# Altium schematic sheet TopLevelBlock.SchDoc: Low Power MCU to cloud reference
size A4; DrawnBy: Dheeraj R; DocumentNumber: 1; Revision: 2.0; SheetNumber: 1; SheetTotal: 5
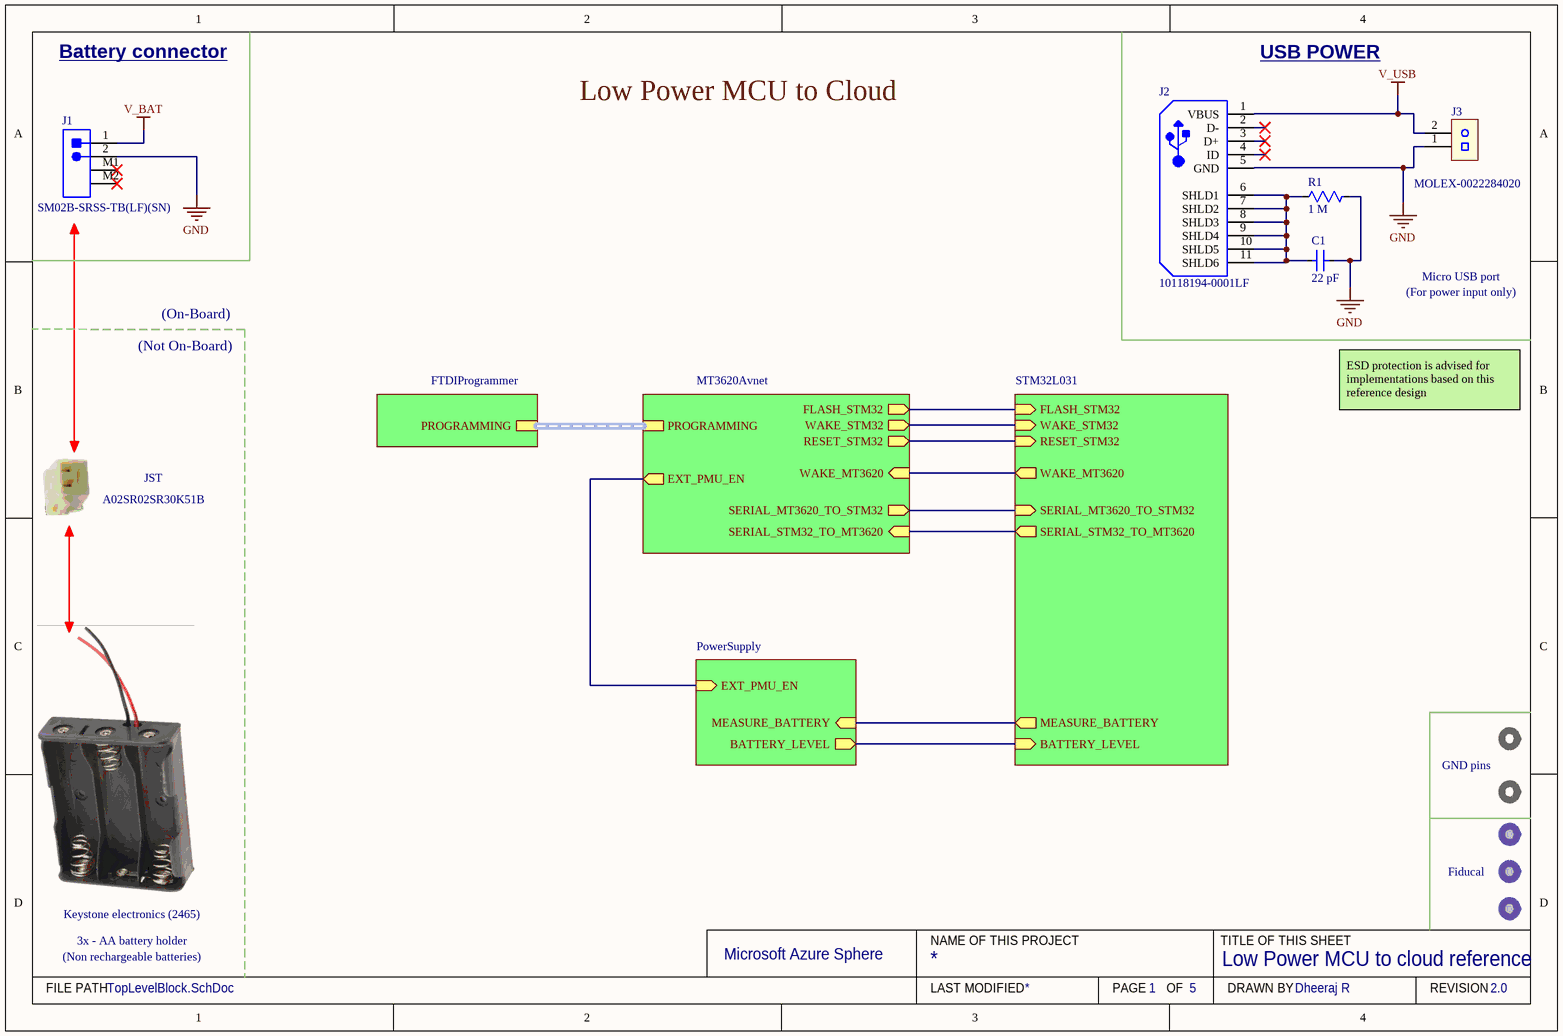
[diagram p0: TopLevelBlock.SchDoc]

## Parts
C1  22 pF  [CC0603]
J1  SM02B-SRSS-TB(LF)(SN)  [SM02B-SRSS-TB]
J2  Manufacturer Part Number: 10118194-0001LF  [FCI-10118194-0001LF-5_V no slots]  (hidden comment: Amphenol FCI 10118194-0001LF)
J3  MOLEX-0022284020  [0022284020]
R1  1 M  [RC0603]

## Sub-sheets
FTDIProgrammer = FTDIProgrammer.SchDoc: PROGRAMMING (harness FTDIHeader)
MT3620Avnet = MT3620AvnetModule.SchDoc: SERIAL_MT3620_TO_STM32 (out), SERIAL_STM32_TO_MT3620 (in), FLASH_STM32 (out), RESET_STM32 (out), WAKE_MT3620 (in), WAKE_STM32 (out), PROGRAMMING (harness FTDIHeader), EXT_PMU_EN (out)
PowerSupply = PowerSupply.SchDoc: EXT_PMU_EN (in), MEASURE_BATTERY (in), BATTERY_LEVEL (out)
STM32L031 = STM32L031.SchDoc: SERIAL_STM32_TO_MT3620 (out), FLASH_STM32 (in), WAKE_MT3620 (out), WAKE_STM32 (in), RESET_STM32 (in), MEASURE_BATTERY (out), BATTERY_LEVEL (in), SERIAL_MT3620_TO_STM32 (in)

## Nets
GND: C1.2 J1.2 J2.5(GND) J3.1 R1.1
V_BAT: J1.1
V_USB: J2.1(VBUS) J3.2
NetC1_1: C1.1 J2.6(SHLD1) J2.7(SHLD2) J2.8(SHLD3) J2.9(SHLD4) J2.10(SHLD5) J2.11(SHLD6) R1.2
(unnamed): sheet MT3620Avnet/SERIAL_MT3620_TO_STM32, sheet STM32L031/SERIAL_MT3620_TO_STM32
(unnamed): sheet MT3620Avnet/SERIAL_STM32_TO_MT3620, sheet STM32L031/SERIAL_STM32_TO_MT3620
(unnamed): sheet MT3620Avnet/FLASH_STM32, sheet STM32L031/FLASH_STM32
(unnamed): sheet MT3620Avnet/RESET_STM32, sheet STM32L031/RESET_STM32
(unnamed): sheet MT3620Avnet/WAKE_MT3620, sheet STM32L031/WAKE_MT3620
(unnamed): sheet MT3620Avnet/WAKE_STM32, sheet STM32L031/WAKE_STM32
(unnamed): sheet MT3620Avnet/EXT_PMU_EN, sheet PowerSupply/EXT_PMU_EN
(unnamed): sheet PowerSupply/MEASURE_BATTERY, sheet STM32L031/MEASURE_BATTERY
(unnamed): sheet PowerSupply/BATTERY_LEVEL, sheet STM32L031/BATTERY_LEVEL

Not connected (* = marked no-connect by the designer): J1 M1* M2*; J2 2(D-)* 3(D+)* 4(ID)*

## Buses and harness runs
harness sheet FTDIProgrammer/PROGRAMMING = sheet MT3620Avnet/PROGRAMMING

## Notes on the sheet
- Battery connector
- Low Power MCU to Cloud
- USB POWER
- (On-Board)
- Micro USB port
- (For power input only)
- (Not On-Board)
- ESD protection is advised for implementations based on this reference design
- A02SR02SR30K51B
- JST
- GND pins
- Keystone electronics (2465)
- Fiducal
- 3x - AA battery holder
- (Non rechargeable batteries)
- Microsoft Azure Sphere
- NAME OF THIS PROJECT
- TITLE OF THIS SHEET
- FILE PATH
- LAST MODIFIED
- PAGE
- OF
- DRAWN BY
- REVISION

## Library data of the parts
C1 = CC0603JRNPO0BN220: 22PF 0603 100V C0G/NPO; Manufacturer: Yageo; Dielectric: C0G; Tolerance: 5%; Supplier 1: Digi-Key; Manufacturer Part Number: CC0603JRNPO0BN220; RoHS: Yes; Category: Ceramic Capacitors; Stock 1: 18072; Pricing 1: 1=0.10000, 10=0.06800, 50=0.03680, 100=0.03010, 500=0.02152, 1000=0.01691 (USD); Mount: Surface Mount; Case/Package: 0603; Weight: 7.1E-05oz; Case Code (Imperial): 0603; Case Code (Metric): 1608; Min Operating Temperature: -55°C; Max Operating Temperature: 125°C; Capacitance: 22pF; Termination: SMD/SMT; Composition: Ceramic; Packaging: Tape and Reel; Voltage Rating: 100V; Voltage Rating (DC): 100V; Length: 1.6mm; Height: 0.8mm; Thickness: 0.035inch; Depth: 0.8mm; Width: 0.8mm; Lead Free: Lead Free; ComponentLink1URL: https://datasheet.ciiva.com/13207/upy-gp-np0-16v-to-50v-8-13207786.pdf?src-supplier=Mouser; ComponentLink1Description: https://datasheet.ciiva.com/13207/upy-gp-np0-16v-to-50v-8-13207786.pdf?src-supplier=Mouser; Supplier Part Number 1: 311-1755-1-ND
J1 = SM02B-SRSS-TB(LF)(SN): Conn Shrouded Header HDR 2 POS 1mm Solder RA SMD T/R; Manufacturer: JST; Number of Contacts: 2; Voltage Rating: 50V; Current Rating: 700mA; Insulation Resistance: 100MR; Connector Type: Header,Male Pin; Contact Resistance: 40mR; Max Current Rating: 1A; Supplier 1: Farnell; Manufacturer Part Number: SM02B-SRSS-TB(LF)(SN); Stock 1: 47603; Pricing 1: 100=0.24600, 500=0.21400, 1000=0.17700, 2500=0.15600, 5000=0.13600, 10000=0.13000 (GBP); RoHS: Yes; Mount: Surface Mount; Contact Material: Copper Alloy,Copper; Housing Color: Beige; Material: Polyamide; Housing Material: Polyamide; Contact Shape: Square; Insulation Material: Nylon; Insulation Color: Natural; Color: Natural; Contact Plating: Tin,Copper,Lead; Min Operating Temperature: -25°C; Max Operating Temperature: 85°C; Orientation: Right Angle; Termination: Solder; Number of Rows: 1; Number of Positions: 2; Max Voltage Rating (AC): 50V; Fastening Type: Push,Pull; Packaging: Tape and Reel; Voltage Rating (AC): 50V; Length: 4mm; Pitch: 1mm; Depth: 4.95mm; Lead Pitch: 1mm; Flammability Rating: UL94 V-0; Lead Free: Lead Free; REACH SVHC: No SVHC; ComponentLink1URL: https://datasheet.ciiva.com/26924/getdatasheetpartid-640850-26924055.pdf?src-supplier=Verical; ComponentLink1Description: https://datasheet.ciiva.com/26924/getdatasheetpartid-640850-26924055.pdf?src-supplier=Verical; ComponentLink2URL: https://datasheet.ciiva.com/712/esr-712467.pdf?src-supplier=Digi-Key; ComponentLink2Description: https://datasheet.ciiva.com/712/esr-712467.pdf?src-supplier=Digi-Key; ComponentLink3URL: https://datasheet.ciiva.com/712/esr-712468.pdf?src-supplier=Digi-Key; ComponentLink3Description: https://datasheet.ciiva.com/712/esr-712468.pdf?src-supplier=Digi-Key; ComponentLink4URL: https://datasheet.ciiva.com/730/esr-730600.pdf?src-supplier=Digi-Key; ComponentLink4Description: https://datasheet.ciiva.com/730/esr-730600.pdf?src-supplier=Digi-Key; ComponentLink5URL: https://datasheet.ciiva.com/8052/91630-8052284.pdf?src-supplier=Element14; ComponentLink5Description: https://datasheet.ciiva.com/8052/91630-8052284.pdf?src-supplier=Element14; ComponentLink6URL: https://datasheet.ciiva.com/16391/sm02b-srss-tblfsn-16391308.pdf?src-supplier=Future+Electronics; ComponentLink6Description: https://datasheet.ciiva.com/16391/sm02b-srss-tblfsn-16391308.pdf?src-supplier=Future+Electronics; Supplier Part Number 1: 1679117
J2 = Amphenol FCI 10118194-0001LF: CONN USB MICRO B RECPT SMT R/A; Connector Type: USB - micro B; Number of Contacts: 5; Gender: Receptacle; Specifications: USB 2.0; Number of Ports: 1; Current Rating: 1.8A per Contact; Voltage - Rated: 100VAC; Mating Cycles: 10000; Shielding: Shielded; Material Flammability Rating: UL94 V-0; Insulation Resistance: 1GR; Max Voltage Rating (AC): 100V; Pitch: 0.65mm; Created By: HUGHWI; Manufacturer: Amphenol FCI; RoHS: RoHS Compliant; Category: Connectors, Interconnects; Packaging: Cut Tape (CT); Part Status: Active; Mounting Type: Surface Mount, Right Angle; Through Hole; Mounting Feature: Horizontal; Termination: Solder; Features: Solder Retention; Ingress Protection: -; Operating Temperature: -30°C ~ 80°C; Contact Finish: Gold; Shell/Shielding Material: Steel, Stainless; Insulation Color: Black; ComponentLink1URL: http://portal.fciconnect.com/Comergent//fci/drawing/10118194.pdf; ComponentLink1Description: FCI drawing; ComponentLink2Description: FCI datasheet; ComponentLink2URL: https://cdn.amphenol-icc.com/media/wysiwyg/files/documentation/datasheet/inputoutput/io_usb_micro.pdf; Supplier 1: Mouser; Stock 1: 7344; Pricing 1: 1=0.43000, 10=0.32000, 100=0.26800, 1200=0.21400, 2400=0.17500, 9600=0.17500 (USD); Mount: Surface Mount,Horizontal; Contact Plating: Gold; Color: Black; Contact Material: Copper Alloy; Number of Terminals/Pins: 5; Housing Material: Polymer; Min Operating Temperature: -55°C; Max Operating Temperature: 85°C; Orientation: Right Angle; Package Quantity: 9600; Length: 8.05mm; Depth: 5mm; Radiation Hardening: No; Flammability Rating: UL94 V-0; Lead Free: Lead Free; Supplier 2: Arrow Electronics; Stock 2: 5099; Pricing 2: 1=0.44910, 10=0.42910, 25=0.36770, 50=0.31260, 100=0.30030, 250=0.26960, 500=0.25740, 9600=0.19900, 96000=0.19390, 960000=0.16330, 4800000=0.14520, 9600000=0.14500 (USD); Supplier 3: Future Electronics; Stock 3: 725; Pricing 3: 1=0.42000, 50=0.31500, 100=0.30000, 250=0.28000, 500=0.26500 (USD); Supplier Part Number 1: 649-10118194-0001LF; Supplier Part Number 2: 10118194-0001LF; Supplier Part Number 3: 9100242
J3 = MOLEX-0022284020: CONN HEADER 2POS .100 VERT TIN; Manufacturer: Molex, LLC; Connector Type: Header, Unshrouded, Breakaway; Number of Positions: 2; Number of Positions Loaded: All; Pitch: 0.100" (2.54mm); Supplier 1: Digi-Key; Manufacturer Part Number: 0022284020; RoHS: RoHS Compliant; Category: Connectors, Interconnects; Stock 1: 10077; Pricing 1: 1=0.12, 10=0.108, 25=0.0808, 50=0.0692, 100=0.0668, 250=0.0576, 500=0.0553 (GBP); Packaging: Bulk; Contact Type: Male Pin; Number of Rows: 1; Row Spacing: -; Contact Mating Length: 0.240" (6.10mm); Mounting Type: Through Hole; Termination: Solder; Fastening Type: -; Features: -; Contact Finish: Tin; Contact Finish Thickness: 100µin (2.54µm); Color: Black; ComponentLink1URL: http://www.molex.com/pdm_docs/sd/022284020_sd.pdf; ComponentLink1Description: http://www.molex.com/pdm_docs/sd/022284020_sd.pdf; Supplier Part Number 1: WM50014-02-ND
R1 = RC0603FR-071ML: 1M 0603 Case 1% 0.1W 100ppm/C; Manufacturer: Yageo; Voltage Rating: 50V; Resistance: 1MR; Power Rating: 100mW; Temperature Coefficient: 100ppm/°C; Supplier 1: Digi-Key; Manufacturer Part Number: RC0603FR-071ML; RoHS: Yes; Category: Chip SMD Resistors; Stock 1: 2071757; Pricing 1: 1=0.10000, 10=0.02300, 100=0.00940, 1000=0.00421, 2500=0.00366 (USD); Case/Package: 0603; Number of Pins: 2; Case Code (Imperial): 0603; Case Code (Metric): 1608; Min Operating Temperature: -55°C; Max Operating Temperature: 155°C; Voltage Rating (DC): 50V; Tolerance: 1%; Packaging: Tape and Reel; Package Quantity: 5000; Termination: SMD/SMT; Composition: Thick Film; Military Standard: Not; Length: 1.6mm; Height: 0.45mm; Width: 0.8mm; Depth: 0.8mm; REACH SVHC: No SVHC; Lead Free: Lead Free; ComponentLink1URL: https://datasheet.ciiva.com/11819/0900766b80f96399-11819295.pdf?src-supplier=RSComponents; ComponentLink1Description: https://datasheet.ciiva.com/11819/0900766b80f96399-11819295.pdf?src-supplier=RSComponents; ComponentLink2URL: https://datasheet.ciiva.com/7983/443971-7983614.pdf?src-supplier=Element14; ComponentLink2Description: https://datasheet.ciiva.com/7983/443971-7983614.pdf?src-supplier=Element14; ComponentLink3URL: https://datasheet.ciiva.com/12555/rc0603-272842-12555388.pdf?src-supplier=Mouser; ComponentLink3Description: https://datasheet.ciiva.com/12555/rc0603-272842-12555388.pdf?src-supplier=Mouser; Supplier Part Number 1: 311-1.00MHRCT-ND